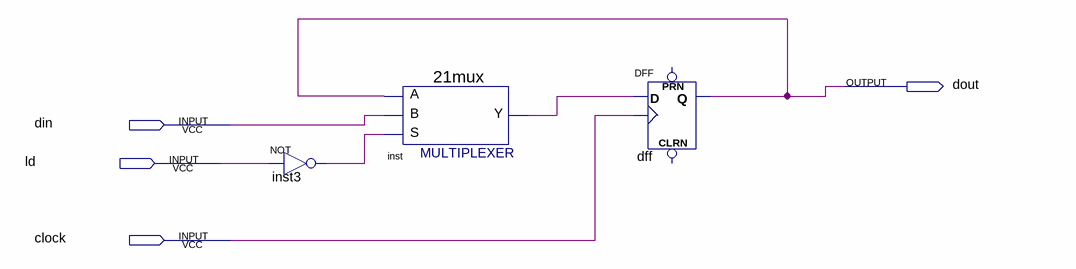
[diagram p0: schematic sheet]
// Quartus schematic regcell.bdf as structural Verilog: 3 symbols, 4 pins
module regcell (
  input  din,
  input  ld,
  input  clock,
  output dout
);

  wire inst3_out, inst_y;

  not inst3 (inst3_out, ld);
  \21mux  inst (.S(inst3_out), .B(din), .A(dout), .Y(inst_y));
  DFF dff (.CLK(clock), .D(inst_y), .Q(dout));  // open: CLRN, PRN
endmodule
